# Altium schematic sheet wifi.SchDoc: Wifi System
size A4; Organization: Tweetonig; Address1: Delftsestraat 11; DocumentNumber: 5; Revision: 1.0; SheetNumber: 5; SheetTotal: 9
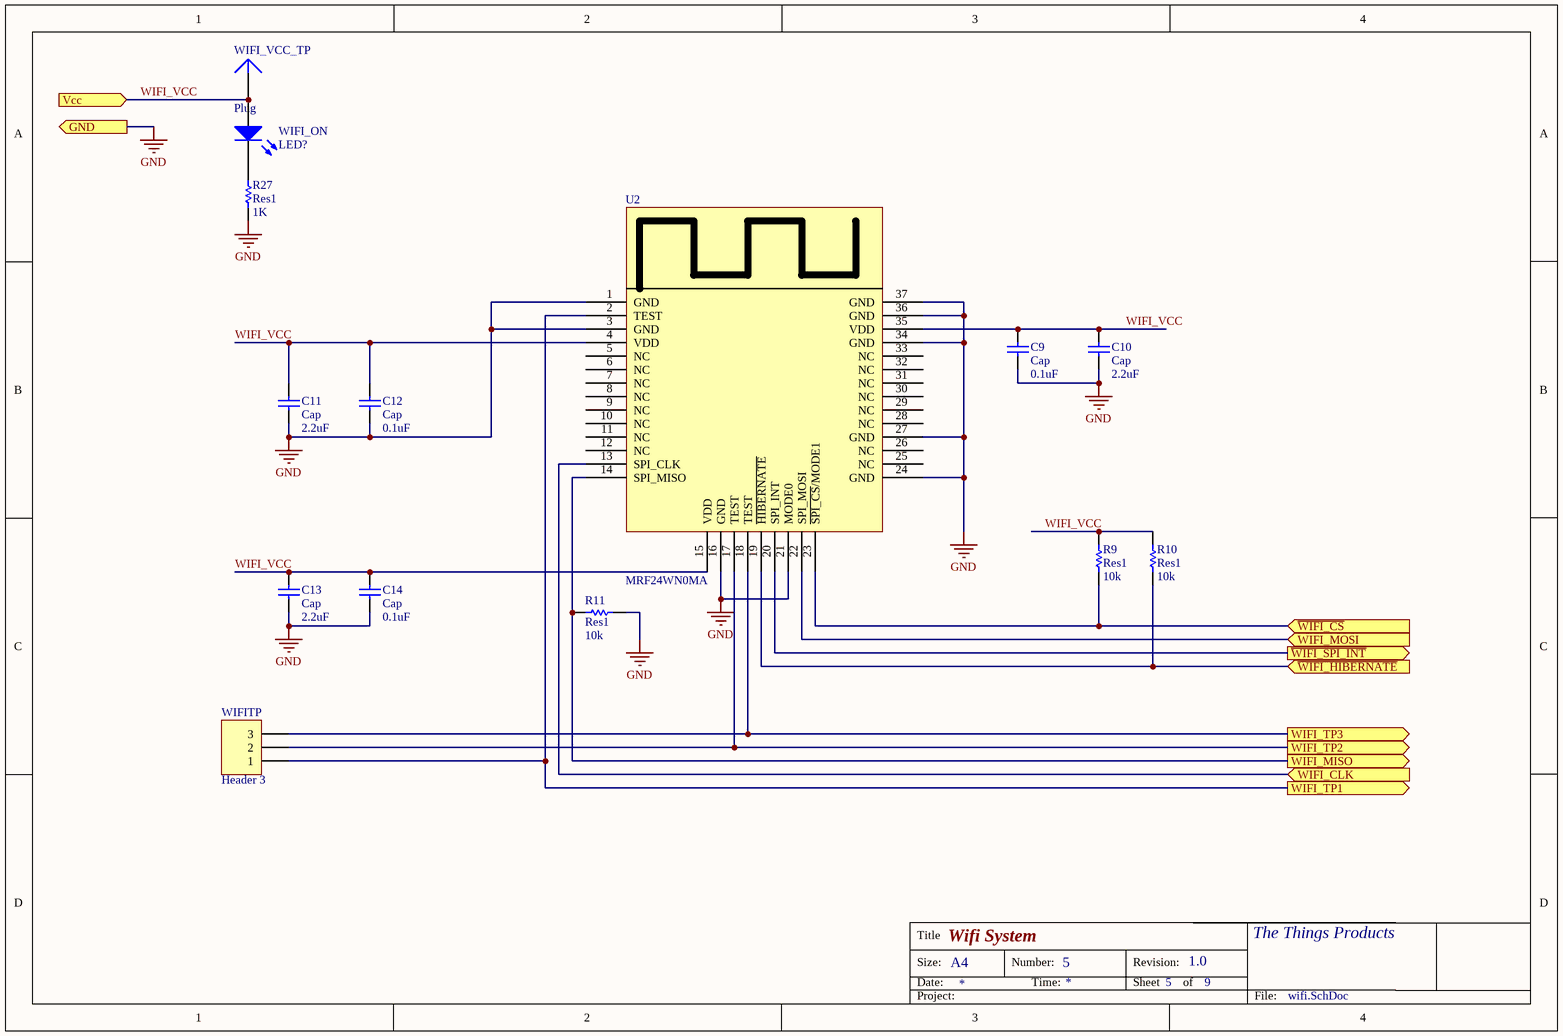
[diagram p0: wifi.SchDoc]

## Parts
C9  Cap  value 0.1uF  [C0603]
C10  Cap  value 2.2uF  [C0603]
C11  Cap  value 2.2uF  [C0603]
C12  Cap  value 0.1uF  [C0603]
C13  Cap  value 2.2uF  [C0603]
C14  Cap  value 0.1uF  [C0603]
R9  Res1  value 10k  [R0603]
R10  Res1  value 10k  [R0603]
R11  Res1  value 10k  [R0603]
R27  Res1  value 1K  [R0603]
U2  MRF24WN0MA  [MRF24WN0MA]
WIFI_ON  LED?  [C0603]
WIFI_VCC_TP  Plug  [PIN1]
WIFITP  Header 3  [HDR1X3]

## Ports
GND (out), Vcc (in), WIFI_CLK (in), WIFI_MISO (out), WIFI_MOSI (in), WIFI_TP1 (out), WIFI_TP2 (out), WIFI_TP3 (out), ~{WIFI_CS} (in), ~{WIFI_HIBERNATE} (in), ~{WIFI_SPI_INT} (out)

## Nets
GND: C9.1 C10.1 C11.1 C12.1 C13.1 C14.1 R11.1 R27.1 U2.1(GND) U2.3(GND) U2.16(GND) U2.21(MODE0) U2.24(GND) U2.27(GND) U2.34(GND) U2.36(GND) U2.37(GND) ; port GND
~{WIFI_CS}: R9.1 U2.23(~{SPI_CS}/MODE1) ; port ~{WIFI_CS}
~{WIFI_HIBERNATE}: R10.1 U2.19(~{HIBERNATE}) ; port ~{WIFI_HIBERNATE}
~{WIFI_SPI_INT}: U2.20(SPI_INT) ; port ~{WIFI_SPI_INT}
WIFI_CLK: U2.13(SPI_CLK) ; port WIFI_CLK
WIFI_MISO: R11.2 U2.14(SPI_MISO) ; port WIFI_MISO
WIFI_MOSI: U2.22(SPI_MOSI) ; port WIFI_MOSI
WIFI_TP1: U2.2(TEST) WIFITP.1 ; port WIFI_TP1
WIFI_TP2: U2.17(TEST) WIFITP.2 ; port WIFI_TP2
WIFI_TP3: U2.18(TEST) WIFITP.3 ; port WIFI_TP3
WIFI_VCC: C9.2 C10.2 C11.2 C12.2 C13.2 C14.2 R9.2 R10.2 U2.4(VDD) U2.15(VDD) U2.35(VDD) WIFI_ON.1(A) WIFI_VCC_TP.1 ; port Vcc
NetR27_2: R27.2 WIFI_ON.2(K)

Not connected (* = marked no-connect by the designer): U2 5(NC) 6(NC) 7(NC) 8(NC) 9(NC) 10(NC) 11(NC) 12(NC) 25(NC) 26(NC) 28(NC) 29(NC) 30(NC) 31(NC) 32(NC) 33(NC)

## Notes on the sheet
- Title
- Size:
- Date:
- A4
- Number:
- Time:
- Revision:
- Sheet
- of
- The Things Products
- Project:
- File:

## Library data of the parts
C9-C14 = Cap: Capacitor; Published: 8-Jun-2000; LatestRevisionDate: 17-Jul-2002; LatestRevisionNote: Re-released for DXP Platform.; PackageReference: RAD-0.3; Publisher: Altium Limited; PackageDescription: Radial Cap, Thru-Hole; 2 Leads; 0.3 in Pin Spacing
R9-R11 R27 = Res1: Resistor; Published: 8-Jun-2000; LatestRevisionDate: 17-Jul-2002; LatestRevisionNote: Re-released for DXP Platform.; PackageReference: AXIAL-0.3; Publisher: Altium Limited; PackageDescription: Axial Device, Thru-Hole; 2 Leads; 0.3 in Pin Spacing
U2 = MRF24WN0MA: MRF24WN0MA Wifi SOC
WIFI_ON = LED0: Typical INFRARED GaAs LED; Published: 8-Jun-2000; LatestRevisionDate: 08-Jul-2005; LatestRevisionNote: Mech Layer 1 removed.; PackageReference: LED-0; Publisher: Altium Limited; PackageDescription: LED; 2 Leads
WIFITP = Header 3: Header, 3-Pin; LatestRevisionDate: 17-Jul-2002; LatestRevisionNote: Re-released for DXP Platform.; Publisher: Altium Limited
WIFI_VCC_TP = Plug: LatestRevisionDate: 17-Jul-2002; LatestRevisionNote: Re-released for DXP Platform.; Publisher: Altium Limited